# Altium schematic sheet 3  - Fuses.SchDoc
size 330 x 215 mm
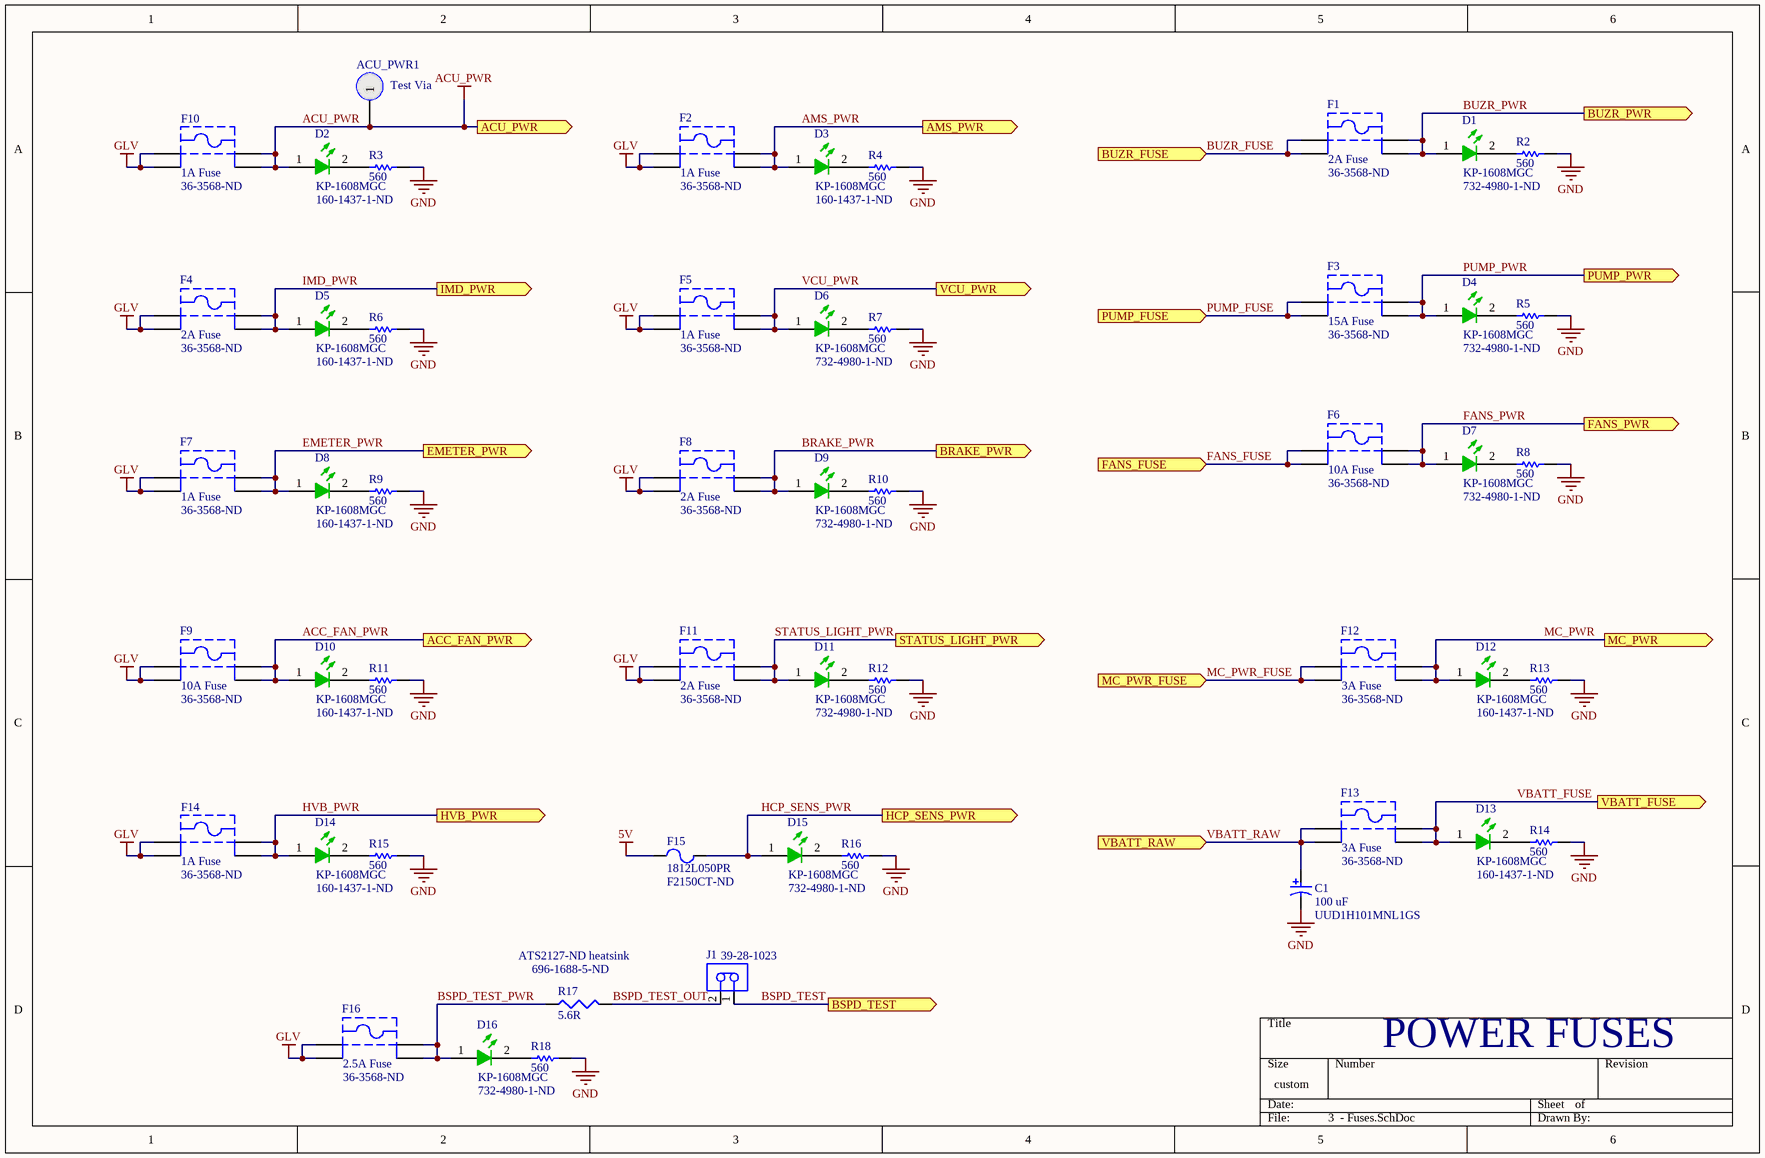
[diagram p0: 3  - Fuses.SchDoc]

## Parts
ACU_PWR1  Test Via  [Test Via]
C1  UUD1H101MNL1GS  Rated Capacitance: 100 uF  [NIC-CAPA2-8X10_V]
D1  KP-1608MGC  Supplier Part Number 1: 732-4980-1-ND  [KING-0603LED_GREEN_V]
D2  KP-1608MGC  Supplier Part Number 1: 160-1437-1-ND  [KING-0603LED_GREEN_V]
D3  KP-1608MGC  Supplier Part Number 1: 160-1437-1-ND  [KING-0603LED_GREEN_V]
D4  KP-1608MGC  Supplier Part Number 1: 732-4980-1-ND  [KING-0603LED_GREEN_V]
D5  KP-1608MGC  Supplier Part Number 1: 160-1437-1-ND  [KING-0603LED_GREEN_V]
D6  KP-1608MGC  Supplier Part Number 1: 732-4980-1-ND  [KING-0603LED_GREEN_V]
D7  KP-1608MGC  Supplier Part Number 1: 732-4980-1-ND  [KING-0603LED_GREEN_V]
D8  KP-1608MGC  Supplier Part Number 1: 160-1437-1-ND  [KING-0603LED_GREEN_V]
D9  KP-1608MGC  Supplier Part Number 1: 732-4980-1-ND  [KING-0603LED_GREEN_V]
D10  KP-1608MGC  Supplier Part Number 1: 160-1437-1-ND  [KING-0603LED_GREEN_V]
D11  KP-1608MGC  Supplier Part Number 1: 732-4980-1-ND  [KING-0603LED_GREEN_V]
D12  KP-1608MGC  Supplier Part Number 1: 160-1437-1-ND  [KING-0603LED_GREEN_V]
D13  KP-1608MGC  Supplier Part Number 1: 160-1437-1-ND  [KING-0603LED_GREEN_V]
D14  KP-1608MGC  Supplier Part Number 1: 160-1437-1-ND  [KING-0603LED_GREEN_V]
D15  KP-1608MGC  Supplier Part Number 1: 732-4980-1-ND  [KING-0603LED_GREEN_V]
D16  KP-1608MGC  Supplier Part Number 1: 732-4980-1-ND  [KING-0603LED_GREEN_V]
F1  36-3568-ND  [KSTN-3568_V]
F2  36-3568-ND  [KSTN-3568_V]
F3  36-3568-ND  [KSTN-3568_V]
F4  36-3568-ND  [KSTN-3568_V]
F5  36-3568-ND  [KSTN-3568_V]
F6  36-3568-ND  [KSTN-3568_V]
F7  36-3568-ND  [KSTN-3568_V]
F8  36-3568-ND  [KSTN-3568_V]
F9  36-3568-ND  [KSTN-3568_V]
F10  36-3568-ND  [KSTN-3568_V]
F11  36-3568-ND  [KSTN-3568_V]
F12  36-3568-ND  [KSTN-3568_V]
F13  36-3568-ND  [KSTN-3568_V]
F14  36-3568-ND  [KSTN-3568_V]
F15  1812L050PR  Supplier Part Number 1: F2150CT-ND  [LFUS-1812L050_V]
F16  36-3568-ND  [KSTN-3568_V]
J1  39-28-1023  [MOLX-39-28-1023-2_V]
R2  560  [RESC0603(1608)_L]
R3  560  [RESC0603(1608)_L]
R4  560  [RESC0603(1608)_L]
R5  560  [RESC0603(1608)_L]
R6  560  [RESC0603(1608)_L]
R7  560  [RESC0603(1608)_L]
R8  560  [RESC0603(1608)_L]
R9  560  [RESC0603(1608)_L]
R10  560  [RESC0603(1608)_L]
R11  560  [RESC0603(1608)_L]
R12  560  [RESC0603(1608)_L]
R13  560  [RESC0603(1608)_L]
R14  560  [RESC0603(1608)_L]
R15  560  [RESC0603(1608)_L]
R16  560  [RESC0603(1608)_L]
R17  5.6R  Supplier Part Number 1: 696-1688-5-ND  [TO220AC]
R18  560  [RESC0603(1608)_L]

## Ports
ACC_FAN_PWR (out), ACU_PWR (out), AMS_PWR (out), BRAKE_PWR (out), BSPD_TEST (out), BUZR_FUSE (in), BUZR_PWR (out), EMETER_PWR (out), FANS_FUSE (in), FANS_PWR (out), HCP_SENS_PWR (out), HVB_PWR (out), IMD_PWR (out), MC_PWR (out), MC_PWR_FUSE (in), PUMP_FUSE (in), PUMP_PWR (out), STATUS_LIGHT_PWR (out), VBATT_FUSE (out), VBATT_RAW (in), VCU_PWR (out)

## Nets
5V: F15.1
ACU_PWR: ACU_PWR1.1 D2.1(A) F10.3 F10.4 ; port ACU_PWR
GLV: F2.1 F2.2 F4.1 F4.2 F5.1 F5.2 F7.1 F7.2 F8.1 F8.2 F9.1 F9.2 F10.1 F10.2 F11.1 F11.2 F14.1 F14.2 F16.1 F16.2
GND: C1.2 R2.2 R3.2 R4.2 R5.2 R6.2 R7.2 R8.2 R9.2 R10.2 R11.2 R12.2 R13.2 R14.2 R15.2 R16.2 R18.2
ACC_FAN_PWR: D10.1(A) F9.3 F9.4 ; port ACC_FAN_PWR
AMS_PWR: D3.1(A) F2.3 F2.4 ; port AMS_PWR
BRAKE_PWR: D9.1(A) F8.3 F8.4 ; port BRAKE_PWR
BSPD_TEST: J1.1 ; port BSPD_TEST
BSPD_TEST_OUT: J1.2 R17.2
BSPD_TEST_PWR: D16.1(A) F16.3 F16.4 R17.1
BUZR_FUSE: F1.1 F1.2 ; port BUZR_FUSE
BUZR_PWR: D1.1(A) F1.3 F1.4 ; port BUZR_PWR
EMETER_PWR: D8.1(A) F7.3 F7.4 ; port EMETER_PWR
FANS_FUSE: F6.1 F6.2 ; port FANS_FUSE
FANS_PWR: D7.1(A) F6.3 F6.4 ; port FANS_PWR
HCP_SENS_PWR: D15.1(A) F15.2 ; port HCP_SENS_PWR
HVB_PWR: D14.1(A) F14.3 F14.4 ; port HVB_PWR
IMD_PWR: D5.1(A) F4.3 F4.4 ; port IMD_PWR
MC_PWR: D12.1(A) F12.3 F12.4 ; port MC_PWR
MC_PWR_FUSE: F12.1 F12.2 ; port MC_PWR_FUSE
PUMP_FUSE: F3.1 F3.2 ; port PUMP_FUSE
PUMP_PWR: D4.1(A) F3.3 F3.4 ; port PUMP_PWR
STATUS_LIGHT_PWR: D11.1(A) F11.3 F11.4 ; port STATUS_LIGHT_PWR
VBATT_FUSE: D13.1(A) F13.3 F13.4 ; port VBATT_FUSE
VBATT_RAW: C1.1 F13.1 F13.2 ; port VBATT_RAW
VCU_PWR: D6.1(A) F5.3 F5.4 ; port VCU_PWR
NetD1_2: D1.2(K) R2.1
NetD2_2: D2.2(K) R3.1
NetD3_2: D3.2(K) R4.1
NetD4_2: D4.2(K) R5.1
NetD5_2: D5.2(K) R6.1
NetD6_2: D6.2(K) R7.1
NetD7_2: D7.2(K) R8.1
NetD8_2: D8.2(K) R9.1
NetD9_2: D9.2(K) R10.1
NetD10_2: D10.2(K) R11.1
NetD11_2: D11.2(K) R12.1
NetD12_2: D12.2(K) R13.1
NetD13_2: D13.2(K) R14.1
NetD14_2: D14.2(K) R15.1
NetD15_2: D15.2(K) R16.1
NetD16_2: D16.2(K) R18.1

## Notes on the sheet
- (near F1) 2A Fuse
- (near F10) 1A Fuse
- (near F2) 1A Fuse
- (near F4) 2A Fuse
- (near F5) 1A Fuse
- (near F3) 15A Fuse
- (near F7) 1A Fuse
- (near F8) 2A Fuse
- (near F6) 10A Fuse
- (near F9) 10A Fuse
- (near F11) 2A Fuse
- (near F12) 3A Fuse
- (near F14) 1A Fuse
- (near F13) 3A Fuse
- (near R17) ATS2127-ND heatsink
- (near F16) 2.5A Fuse
- POWER FUSES

## Library data of the parts
C1 = CMP-0687-00073-1: Aluminum Electrolytic Capacitor, UD Series, Low Impedance, 100 uF, 50 V, + / - 20%, -55 to 105 degC, Chip Type, 8 x 10 mm D x L, Pb-Free, Reel; Manufacturer: Nichicon; Rated Ripple Current (at 100kHz): 300 mA; Tolerance Rated Capacitance: -20 to 20%; Packing: Dia382mm Reel; Impedance: 0.34 Ohm; Rated Voltage: 50 V; Endurance Time: 5000 h; Capacitance: 100µF; Voltage Rating: 50V; Lifetime @ Temp.: 5000 Hrs @ 105°C; Polarization: Polar; Ripple Current: 300mA; Surface Mount Land Size: 0.327" L x 0.327" W (8.30mm x 8.30mm); ComponentLink3Description: Package Specification; ComponentLink2Description: Datasheet; PackageReference: CAPAE-D8H10; RoHS: TRUE; Length: 10 mm; Mounting Technology: Surface Mount; PackageDescription: 2-Pin Surface Mount Device, Diameter 8 mm, Height 10 mm, Pitch 6.5 mm; DatasheetVersion: 08/2012; Diameter: 8 mm; ComponentLink3URL: http://products.nichicon.co.jp/en/pdf/XJA043/e-ud.pdf; ComponentLink1Description: Manufacturer URL; PartNumber: UUD1H101MNL1GS; ComponentLink2URL: http://products.nichicon.co.jp/en/pdf/XJA043/e-ud.pdf; ComponentLink1URL: http://www.nichicon.co.jp/; Supplier 1: Digi-Key; Supplier Part Number 1: 493-2306-1-ND; Manufacturer Part Number: UUD1H101MNL1GS; Category: Capacitors; Stock 1: 65948; Pricing 1: 1=0.92, 10=0.685, 25=0.5868, 50=0.5478, 100=0.4696, 250=0.43044 (CAD); Packaging: Cut Tape (CT); Part Status: Active; Tolerance: ±20%; ESR (Equivalent Series Resistance): -; Operating Temperature: -55°C ~ 105°C; Applications: General Purpose; Lead Spacing: -; Size / Dimension: 0.315" Dia (8.00mm); Height - Seated (Max): 0.394" (10.00mm); Mounting Type: Surface Mount; Package / Case: Radial, Can - SMD; ComponentLink4URL: http://nichicon-us.com/english/products/pdfs/e-uud.pdf; ComponentLink4Description: http://nichicon-us.com/english/products/pdfs/e-uud.pdf
D1-D16 = CMP-0404-00001-1: LED, SMT, 0603(1608), 1.1mm thickness, Green; Manufacturer: Kingbright; Reverse Voltage: 5 V; Power Dissipation: 75 mW; Forward Current: 30 mA; Packing Type: 2000 pcs / reel; Mounting Technology: Surface Mount; Storage Temperature: -40 to +85 degC; ComponentLink1URL: http://www.kingbright.com/; PackageDescription: 2-Pin SMT LED, 1.6 x 0.8 mm Pitch; PartNumber: KP-1608MGC; PackageReference: 0603LED_GREEN; ComponentLink1Description: Manufacturer URL; Supplier 1: Digi-Key
F1-F5 F7-F14 F16 = CMP-2000-05464-1: Fuse Holder, 20 A, 500 V, -50 to 145 degC, 4-Pin THD, RoHS; Manufacturer: Keystone; Package Reference: 3568; Datasheet Version: 04/2013; Datasheet URL: https://datasheet.ciiva.com/16294/m60-2p40-16294706.pdf; Manufacturer URL: http://www.keyelco.com/; Mounting Technology: ThroughHole; Package Description: 4-Pin Through Hole Device, Body 16 x 6.73 mm, Pitch 9.9 mm
F6 = CMP-2000-05464-1: Manufacturer: Keystone; Package Reference: 3568; Datasheet Version: 04/2013; Datasheet URL: https://datasheet.ciiva.com/16294/m60-2p40-16294706.pdf; Manufacturer URL: http://www.keyelco.com/; Mounting Technology: ThroughHole; Package Description: 4-Pin Through Hole Device, Body 16 x 6.73 mm, Pitch 9.9 mm
F15 = CMP-1700-00002-1: POLY-FUSE(R) Resettable PTC, 0.5 A, 0.15 to 1 Ohm Resistance, -40 to 85 degC, 1812 (4532 Metric), RoHS, Tape and Reel; Voltage Rating: 50 V; Power Rating: 100 mW; Resistance: 150 kohm; Tolerance: 1%; Case\Package: 0603; ComponentLink2URL: http://www.littelfuse.com/~/media/electronics/datasheets/resettable_ptcs/littelfuse_ptc_1812l_datasheet.pdf.pdf; Pins: 2; Mount: Surface Mount; Width: 0.8 mm; Length: 1.6 mm; Package Quantity: 1; Max Operating Temperature: 155 degC; Case Code (Imperial): 0603; ComponentLink1Description: Manufacturer URL; PackageReference: 1812; ComponentLink1URL: http://www.littelfuse.com/; RoHSCompliant: true; Voltage Rating (DC): 50 V; Packaging: Tape and Reel; PackageDescription: 2-Pin Surface Mount Device, Body 4.55 x 3.24 mm; Min Operating Temperature: -55 degC; DatasheetVersion: Feb-16; REACH SVHC: No SVHC; Case Code (Metric): 1608; ComponentLink2Description: Datasheet; Height: 0.45 mm; Supplier 1: Digi-Key
J1 = CMP-2000-05244-1: Female Header, Pitch 4.2 mm, 1 x 2 Position, Height 12.8 mm, Tail Length 3.5 mm, -40 to 105 degC, RoHS; Manufacturer: Molex; No. of Poles: 2; Working Voltage: 250V; No. of Rows: 1; Current Rating: 13A; Contact Termination: Solder; No. of Contacts: 4; Connector Body Material: –; Voltage Rating V AC: 600V; Mounting Orientation: Straight; Pitch Spacing: 4.2mm; Connector Mounting: PCB; Connector Type: RectangularPower; Manufacturer URL: http://www.molex.com/; Contact Plating: Tin; Gender: Header; Lead Spacing: 4.2mm; Colour: Clear; Series: Mini-FitJr; No. of Ways: 2; MSL: –; Connector Insert Type: Header; Flammability Rating: UL94V-2; Datasheet URL: https://datasheet.ciiva.com/11746/0900766b80460d9e-11746456.pdf; Termination Method: Solder; Mounting Type: PCBoard; Contact Material: Brass; Datasheet Version: Rev. F, 05/2004; SVHC: –; Connector Mounting Orientation: PCB; Contact Gender: –
R2-R16 R18 = CMP-1591-00001-1: 0603 (1608 Metric) Chip Resistor; Case-Metric: 1608; Case-EIA: 0603; PackageReference: RESC0603(1608); Supplier 1: Digi-Key; Supplier Part Number 1: P560BZCT-ND
R17 = Res3: Resistor; Published: 8-Jun-2000; LatestRevisionDate: 29-May-2009; LatestRevisionNote: IPC-7351 Footprint Added.; PackageReference: J1-0603; Publisher: Altium Limited; PackageDescription: Chip Resistor; Supplier 1: Digi-Key